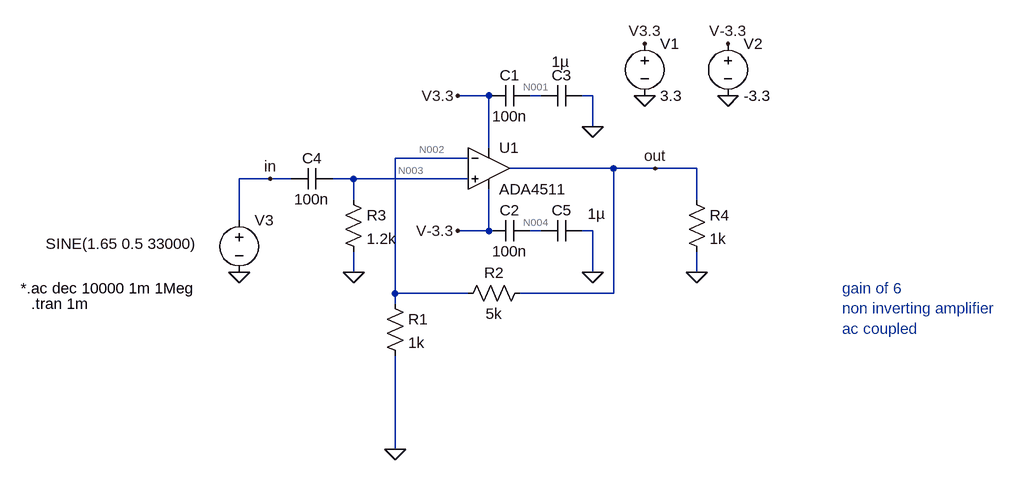
[diagram p0: schematic SpeakerSimulation.asc]
SpeakerSimulation.asc, the LTspice schematic file:
Version 4.1
SHEET 1 1052 932
WIRE 240 32 192 32
WIRE 320 32 304 32
WIRE 400 32 384 32
WIRE 400 80 400 32
WIRE 240 112 240 32
WIRE 208 128 96 128
WIRE 432 144 272 144
WIRE 496 144 432 144
WIRE 560 144 496 144
WIRE -96 160 -144 160
WIRE -64 160 -96 160
WIRE 32 160 0 160
WIRE 208 160 32 160
WIRE 32 192 32 160
WIRE 560 192 560 144
WIRE -144 224 -144 160
WIRE 240 240 240 176
WIRE 240 240 192 240
WIRE 320 240 304 240
WIRE 400 240 384 240
WIRE 32 304 32 272
WIRE 400 304 400 240
WIRE 560 304 560 272
WIRE 96 336 96 128
WIRE 208 336 96 336
WIRE 432 336 432 144
WIRE 432 336 288 336
WIRE 96 352 96 336
WIRE 96 576 96 432
FLAG 480 32 0
FLAG 608 32 0
FLAG 480 -48 V3.3
FLAG 608 -48 V-3.3
FLAG 400 80 0
FLAG 400 304 0
FLAG 192 240 V-3.3
FLAG 192 32 V3.3
FLAG 496 144 out
FLAG 96 576 0
FLAG -144 304 0
FLAG 32 304 0
FLAG -96 160 in
FLAG 560 304 0
SYMBOL OpAmps\\ADA4511 240 80 R0
SYMATTR InstName U1
SYMBOL voltage 480 -64 R0
WINDOW 123 0 0 Left 0
WINDOW 39 0 0 Left 0
SYMATTR InstName V1
SYMATTR Value 3.3
SYMBOL voltage 608 -64 R0
WINDOW 123 0 0 Left 0
WINDOW 39 0 0 Left 0
SYMATTR InstName V2
SYMATTR Value -3.3
SYMBOL cap 304 16 R90
WINDOW 0 0 32 VBottom 2
WINDOW 3 32 32 VTop 2
SYMATTR InstName C1
SYMATTR Value 100n
SYMBOL cap 304 224 R90
WINDOW 0 0 32 VBottom 2
WINDOW 3 32 32 VTop 2
SYMATTR InstName C2
SYMATTR Value 100n
SYMBOL res 80 336 R0
SYMATTR InstName R1
SYMATTR Value 1k
SYMBOL res 304 320 R90
WINDOW 0 0 56 VBottom 2
WINDOW 3 32 56 VTop 2
SYMATTR InstName R2
SYMATTR Value 5k
SYMBOL voltage -144 208 R0
WINDOW 3 -298 52 Left 2
WINDOW 123 -298 80 Left 2
WINDOW 39 0 0 Left 0
SYMATTR Value SINE(1.65 0.5 33000)
SYMATTR InstName V3
SYMBOL cap 0 144 R90
WINDOW 0 0 32 VBottom 2
WINDOW 3 32 32 VTop 2
SYMATTR InstName C4
SYMATTR Value 100n
SYMBOL res 16 176 R0
SYMATTR InstName R3
SYMATTR Value 1.2k
SYMBOL res 544 176 R0
SYMATTR InstName R4
SYMATTR Value 1k
SYMBOL cap 384 16 R90
WINDOW 0 0 32 VBottom 2
WINDOW 3 -52 34 VTop 2
SYMATTR InstName C3
SYMATTR Value 1µ
SYMBOL cap 384 224 R90
WINDOW 0 0 32 VBottom 2
WINDOW 3 -26 -22 VTop 2
SYMATTR InstName C5
SYMATTR Value 1µ
TEXT -480 328 Left 2 !*.ac dec 10000 1m 1Meg
TEXT -464 352 Left 2 !.tran 1m
TEXT 784 328 Left 2 ;gain of 6\nnon inverting amplifier\nac coupled

The netlist it stands for:
* SpeakerSimulation.asc
X§U1 N003 N002 V3.3 V-3.3 out ADA4511  ; pins In+ In- V+ V- OUT
V1 V3.3 0 3.3
V2 V-3.3 0 -3.3
C1 N001 V3.3 100n
C2 N004 V-3.3 100n
R1 N002 0 1k
R2 out N002 5k
V3 in 0 SINE(1.65 0.5 33000)
C4 N003 in 100n
R3 N003 0 1.2k
R4 out 0 1k
C3 0 N001 1µ
C5 0 N004 1µ
*.ac dec 10000 1m 1Meg
.tran 1m
* gain of 6
* non inverting amplifier
* ac coupled
.backanno
.end

* Results of the author's LTspice run, read from the files saved beside the schematic
* Operating Point, zero values left out:
*   V(in) = 1.65 V
*   V(n001) = 330 nV
*   V(n002) = 21.65 µV
*   V(n003) = -6.216 nV
*   V(n004) = -330 nV
*   V(out) = 129.9 µV
*   V(v-3.3) = -3.3 V
*   V(v3.3) = 3.3 V
*   I(R1) = 21.65 nA
*   I(R2) = 21.66 nA
*   I(R3) = -5.18 pA
*   I(R4) = 129.9 nA
*   I(V1) = -1.431 mA
*   I(V2) = 1.431 mA
*   Ix(u1:1) = 5.18 pA
*   Ix(u1:2) = 3.68 pA
*   Ix(u1:3) = 1.431 mA
*   Ix(u1:4) = -1.431 mA
*   Ix(u1:5) = -151.6 nA
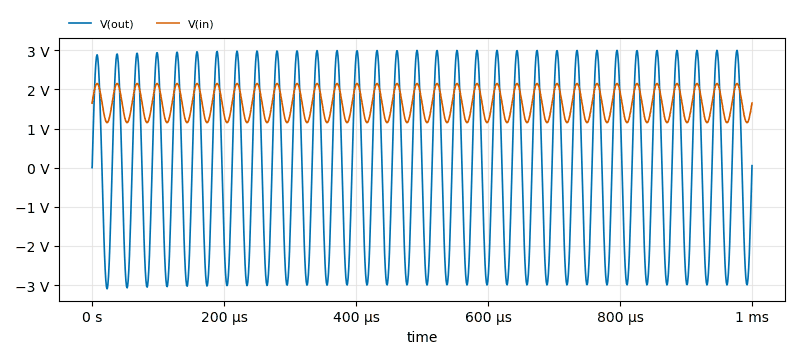
[diagram p1: Transient Analysis of SpeakerSimulation.asc, plotted from the saved traces]
* Transient Analysis, 1 run:
*   V(out): min -3.096 V, max 2.997 V, average -14.27 mV, rms 2.118 V, last 50.78 mV
*   V(in): min 1.15 V, max 2.15 V, average 1.65 V, rms 1.687 V, last 1.65 V